# Altium schematic sheet high_voltage_controller.SchDoc
size A4; SheetNumber: 1; SheetTotal: 5
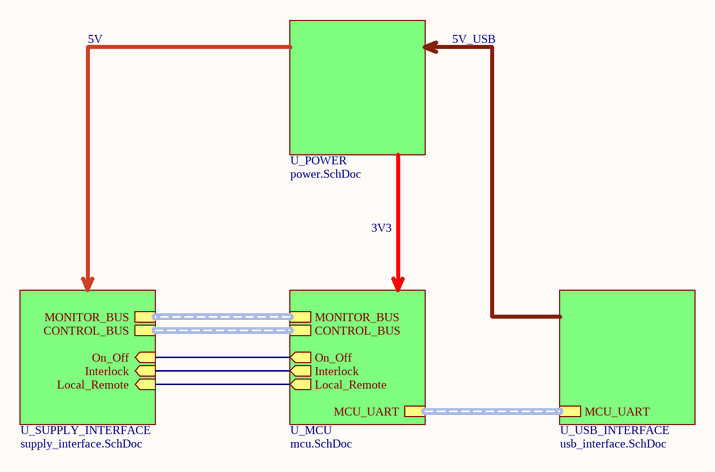
[diagram p0: high_voltage_controller.SchDoc]

## Sub-sheets
U_MCU = mcu.SchDoc: MONITOR_BUS (harness MONITOR_BUS), CONTROL_BUS (harness CONTROL_BUS), MCU_UART (harness MCU_UART), On_Off (out), Local_Remote (out), Interlock (out)
U_POWER = power.SchDoc: no entries
U_SUPPLY_INTERFACE = supply_interface.SchDoc: Local_Remote (in), Interlock (in), On_Off (in), MONITOR_BUS (harness MONITOR_BUS), CONTROL_BUS (harness CONTROL_BUS)
U_USB_INTERFACE = usb_interface.SchDoc: MCU_UART (harness MCU_UART)

## Nets
(unnamed): sheet U_MCU/On_Off, sheet U_SUPPLY_INTERFACE/On_Off
(unnamed): sheet U_MCU/Local_Remote, sheet U_SUPPLY_INTERFACE/Local_Remote
(unnamed): sheet U_MCU/Interlock, sheet U_SUPPLY_INTERFACE/Interlock

## Buses and harness runs
harness sheet U_MCU/CONTROL_BUS = sheet U_SUPPLY_INTERFACE/CONTROL_BUS
harness sheet U_MCU/MCU_UART = sheet U_USB_INTERFACE/MCU_UART
harness sheet U_MCU/MONITOR_BUS = sheet U_SUPPLY_INTERFACE/MONITOR_BUS

## Notes on the sheet
- 5V
- 5V_USB
- 3V3